# EAGLE design pcb_FINAL (EAGLE 9.6.2)
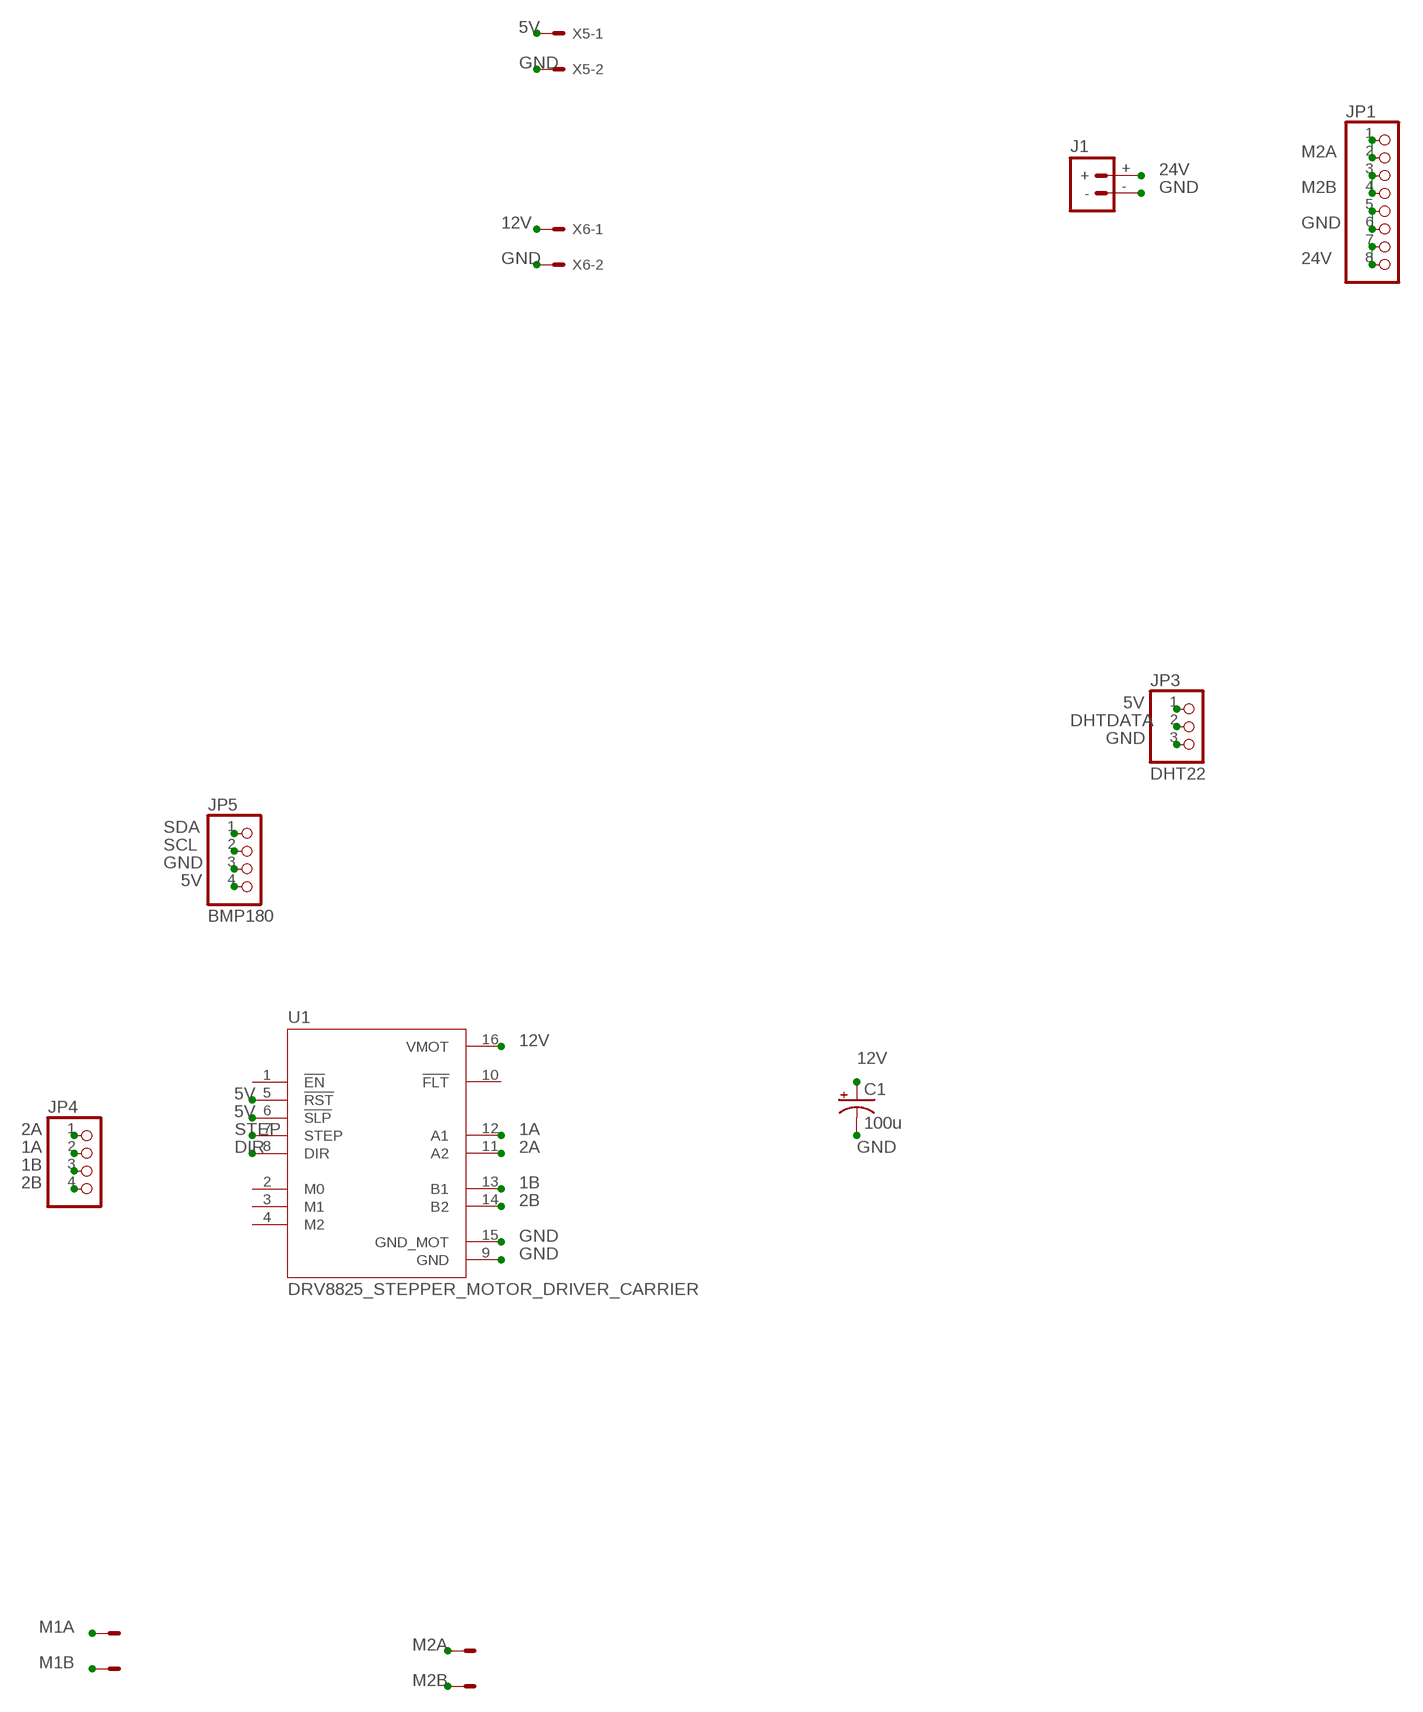
[diagram p0: schematic, sheet 1, part 1 of 2]
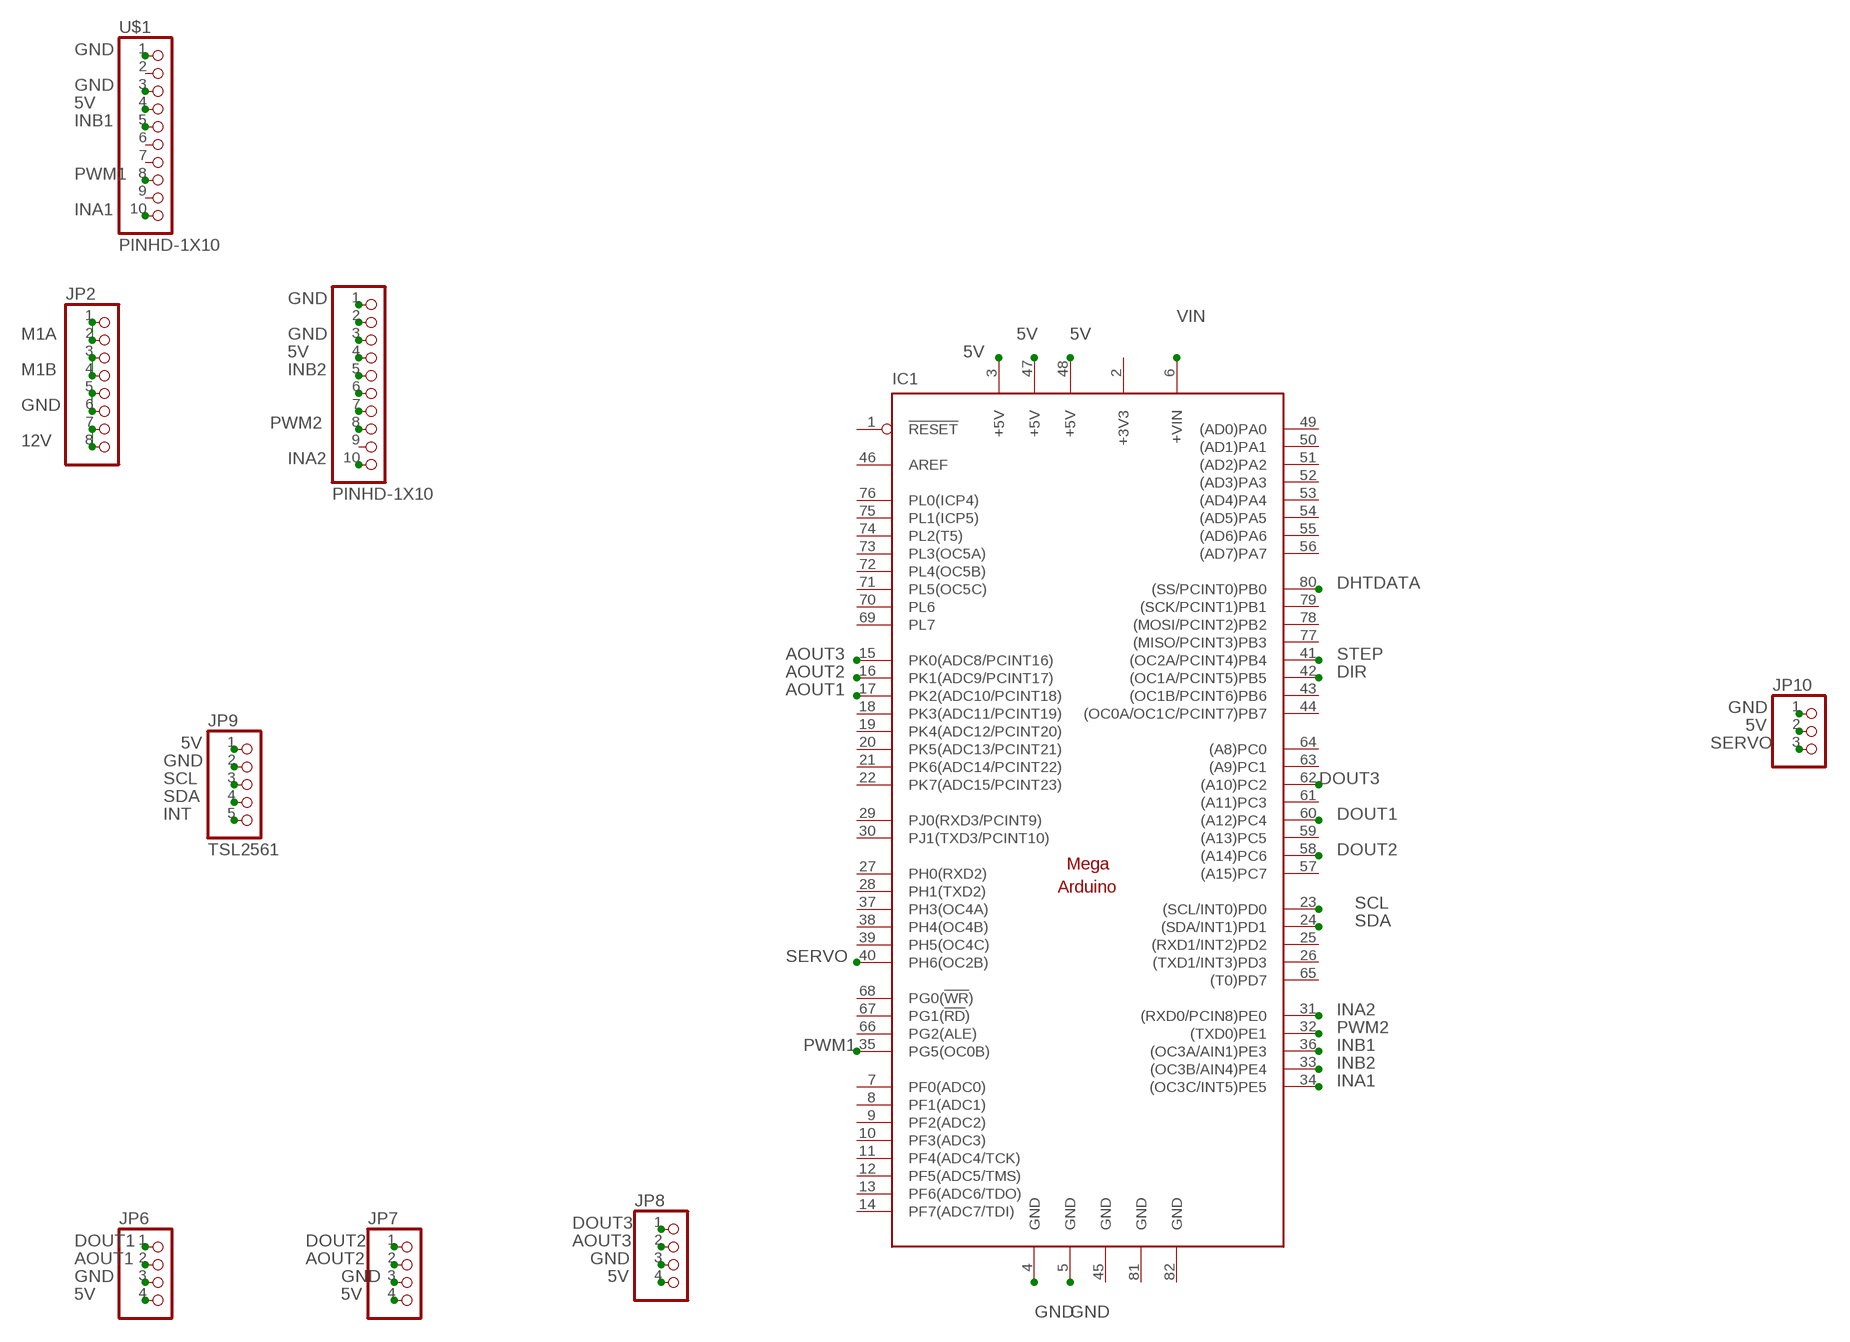
[diagram p1: schematic, sheet 1, part 2 of 2]

## Parts
C1  100u  CPOL-USR/2012-12W  [R/2012-12W]
IC1  ARDUINO_MEGAARDUINO_11  [ARDUINO_MEGA_ARDUINO_1]
J1  BATTERY_CONN_DEANS  [DEANS]
JP1  PINHD-1X8BIG  [1X08-BIG]
JP2  PINHD-1X8BIG  [1X08-BIG]
JP3  DHT22  PINHD-1X3  [1X03]
JP4  PINHD-1X4  [1X04]
JP5  BMP180  PINHD-1X4  [1X04]
JP6  PINHD-1X4  [1X04]
JP7  PINHD-1X4  [1X04]
JP8  PINHD-1X4  [1X04]
JP9  TSL2561  PINHD-1X5  [1X05]
JP10  PINHD-1X3  [1X03]
U1  DRV8825_STEPPER_MOTOR_DRIVER_CARRIER  [IC_DRV8825_STEPPER_MOTOR_DRIVER_CARRIER]
U$1  PINHD-1X10  [1X10-BIG]
U$2  PINHD-1X10  [1X10-BIG]
X3  KK-156-2  [KK-156-2]
X4  KK-156-2  [KK-156-2]
X5  KK-156-2  [KK-156-2]
X6  KK-156-2  [KK-156-2]

## Nets
1A: JP4.2 U1.12(A1)
1B: JP4.3 U1.13(B1)
2A: JP4.1 U1.11(A2)
2B: JP4.4 U1.14(B2)
5V: IC1.3(+5V) IC1.47(+5V) IC1.48(+5V) JP3.1 JP5.4 JP6.4 JP7.4 JP8.4 JP9.1 JP10.2 U1.5(!RST) U1.6(!SLP) U$1.4 U$2.4 X5.1
12V: C1.+ JP2.7 JP2.8 U1.16(VMOT) X6.1
24V: J1.+ JP1.7 JP1.8
AOUT1: IC1.17(PK2(ADC10/PCINT18)) JP6.2
AOUT2: IC1.16(PK1(ADC9/PCINT17)) JP7.2
AOUT3: IC1.15(PK0(ADC8/PCINT16)) JP8.2
DHTDATA: IC1.80((SS/PCINT0)PB0) JP3.2
DIR: IC1.42((OC1A/PCINT5)PB5) U1.8(DIR)
DOUT1: IC1.60((A12)PC4) JP6.1
DOUT2: IC1.58((A14)PC6) JP7.1
DOUT3: IC1.62((A10)PC2) JP8.1
GND: C1.- IC1.4(GND) IC1.5(GND) J1.- JP1.5 JP1.6 JP2.5 JP2.6 JP3.3 JP5.3 JP6.3 JP7.3 JP8.3 JP9.2 JP10.1 U1.9(GND) U1.15(GND_MOT) U$1.1 U$1.3 U$2.1 U$2.3 X5.2 X6.2
INA1: IC1.34((OC3C/INT5)PE5) U$1.10
INA2: IC1.31((RXD0/PCIN8)PE0) U$2.10
INB1: IC1.36((OC3A/AIN1)PE3) U$1.5
INB2: IC1.33((OC3B/AIN4)PE4) U$2.5
INT: JP9.5
M1A: JP2.1 JP2.2 X3.1
M1B: JP2.3 JP2.4 X3.2
M2A: JP1.1 JP1.2 X4.1
M2B: JP1.3 JP1.4 X4.2
N$4: U$2.6
N$5: U$2.7
N$9: U$2.2
PWM1: IC1.35(PG5(OC0B)) U$1.8
PWM2: IC1.32((TXD0)PE1) U$2.8
SCL: IC1.23((SCL/INT0)PD0) JP5.2 JP9.3
SDA: IC1.24((SDA/INT1)PD1) JP5.1 JP9.4
SERVO: IC1.40(PH6(OC2B)) JP10.3
STEP: IC1.41((OC2A/PCINT4)PB4) U1.7(STEP)
VIN: IC1.6(+VIN)
Unconnected: IC1.1(!RESET) IC1.7(PF0(ADC0)) IC1.8(PF1(ADC1)) IC1.9(PF2(ADC2)) IC1.10(PF3(ADC3)) IC1.11(PF4(ADC4/TCK)) IC1.12(PF5(ADC5/TMS)) IC1.13(PF6(ADC6/TDO)) IC1.14(PF7(ADC7/TDI)) IC1.18(PK3(ADC11/PCINT19)) IC1.19(PK4(ADC12/PCINT20)) IC1.20(PK5(ADC13/PCINT21)) IC1.21(PK6(ADC14/PCINT22)) IC1.22(PK7(ADC15/PCINT23)) IC1.25((RXD1/INT2)PD2) IC1.26((TXD1/INT3)PD3) IC1.27(PH0(RXD2)) IC1.28(PH1(TXD2)) IC1.29(PJ0(RXD3/PCINT9)) IC1.30(PJ1(TXD3/PCINT10)) IC1.37(PH3(OC4A)) IC1.38(PH4(OC4B)) IC1.39(PH5(OC4C)) IC1.43((OC1B/PCINT6)PB6) IC1.44((OC0A/OC1C/PCINT7)PB7) IC1.46(AREF) IC1.49((AD0)PA0) IC1.50((AD1)PA1) IC1.51((AD2)PA2) IC1.52((AD3)PA3) IC1.53((AD4)PA4) IC1.54((AD5)PA5) IC1.55((AD6)PA6) IC1.56((AD7)PA7) IC1.57((A15)PC7) IC1.59((A13)PC5) IC1.61((A11)PC3) IC1.63((A9)PC1) IC1.64((A8)PC0) IC1.65((T0)PD7) IC1.66(PG2(ALE)) IC1.67(PG1(!RD!)) IC1.68(PG0(!WR!)) IC1.69(PL7) IC1.70(PL6) IC1.71(PL5(OC5C)) IC1.72(PL4(OC5B)) IC1.73(PL3(OC5A)) IC1.74(PL2(T5)) IC1.75(PL1(ICP5)) IC1.76(PL0(ICP4)) IC1.77((MISO/PCINT3)PB3) IC1.78((MOSI/PCINT2)PB2) IC1.79((SCK/PCINT1)PB1) U1.1(!EN) U1.2(M0) U1.3(M1) U1.4(M2) U1.10(!FLT) U$1.2 U$1.6 U$1.7 U$1.9 U$2.9

## Power pins joined to a net without a drawn wire
+3V3: IC1.2(+3V3)
GND: IC1.45(GND) IC1.81(GND) IC1.82(GND)

## Library data of the parts
C1 = adafruit:CPOL-US: POLARIZED CAPACITOR, American symbol
IC1 = arduino (1):ARDUINO_MEGAARDUINO_1: The Arduino Mega is a microcontroller board based on the ATmega1280. - 54 digital input/output pins (of which 14 can be used as PWM outputs) - 16 analog inputs - 4 UARTs (hardware serial ports) - 16 MHz crystal oscillator - USB connection - power jack - ICSP header - reset button It contains everything needed to support the microcontroller; simply connect it to a computer with a USB cable or power it with a AC-to-DC adapter or battery to get started. The Mega is compatible with most shields designed for the Arduino Duemilanove or Diecimila. http://arduino.cc/en/Main/ArduinoBoardMega
J1 = SparkFun-Connectors:BATTERY_CONN: Battery Connectors Various footprints for battery connections SparkFun Products: Deans Connector -M/F Pair <https://www.sparkfun.com/products/11864>; SF_ID: PRT-11864
JP1 JP2 = adafruit:PINHD-1X8: PIN HEADER
JP3 JP10 = adafruit:PINHD-1X3: PIN HEADER
JP4-JP8 = pinhead:PINHD-1X4: PIN HEADER
JP9 = pinhead:PINHD-1X5: PIN HEADER
U1 = DRV8825_STEPPER_MOTOR_DRIVER_CARRIER:DRV8825_STEPPER_MOTOR_DRIVER_CARRIER: Stepper motor controler; IC: DRV8825; 1.5A; Uin mot: 8.2÷45V Check availability <https://pricing.snapeda.com/parts/DRV8825%20STEPPER%20MOTOR%20DRIVER%20CARRIER/Pololu/view-part?ref=eda>; AVAILABILITY: Not in stock; DESCRIPTION: Stepper, Bipolar 8.2 ~ 45VDC Supply 1.5A 8.2 ~ 45V Load; MF: Pololu; MP: DRV8825 STEPPER MOTOR DRIVER CARRIER; PACKAGE: None; PRICE: None
U$1 U$2 = adafruit:PINHD-1X10: Pin header 1x10 0.1" spacing With round pins
X3-X6 = con-molex:KK-156-2: KK 156 HEADER Source: http://www.molex.com/pdm_docs/sd/026604100_sd.pdf; MF: MOLEX; OC_FARNELL: unknown; OC_NEWARK: unknown

## Board
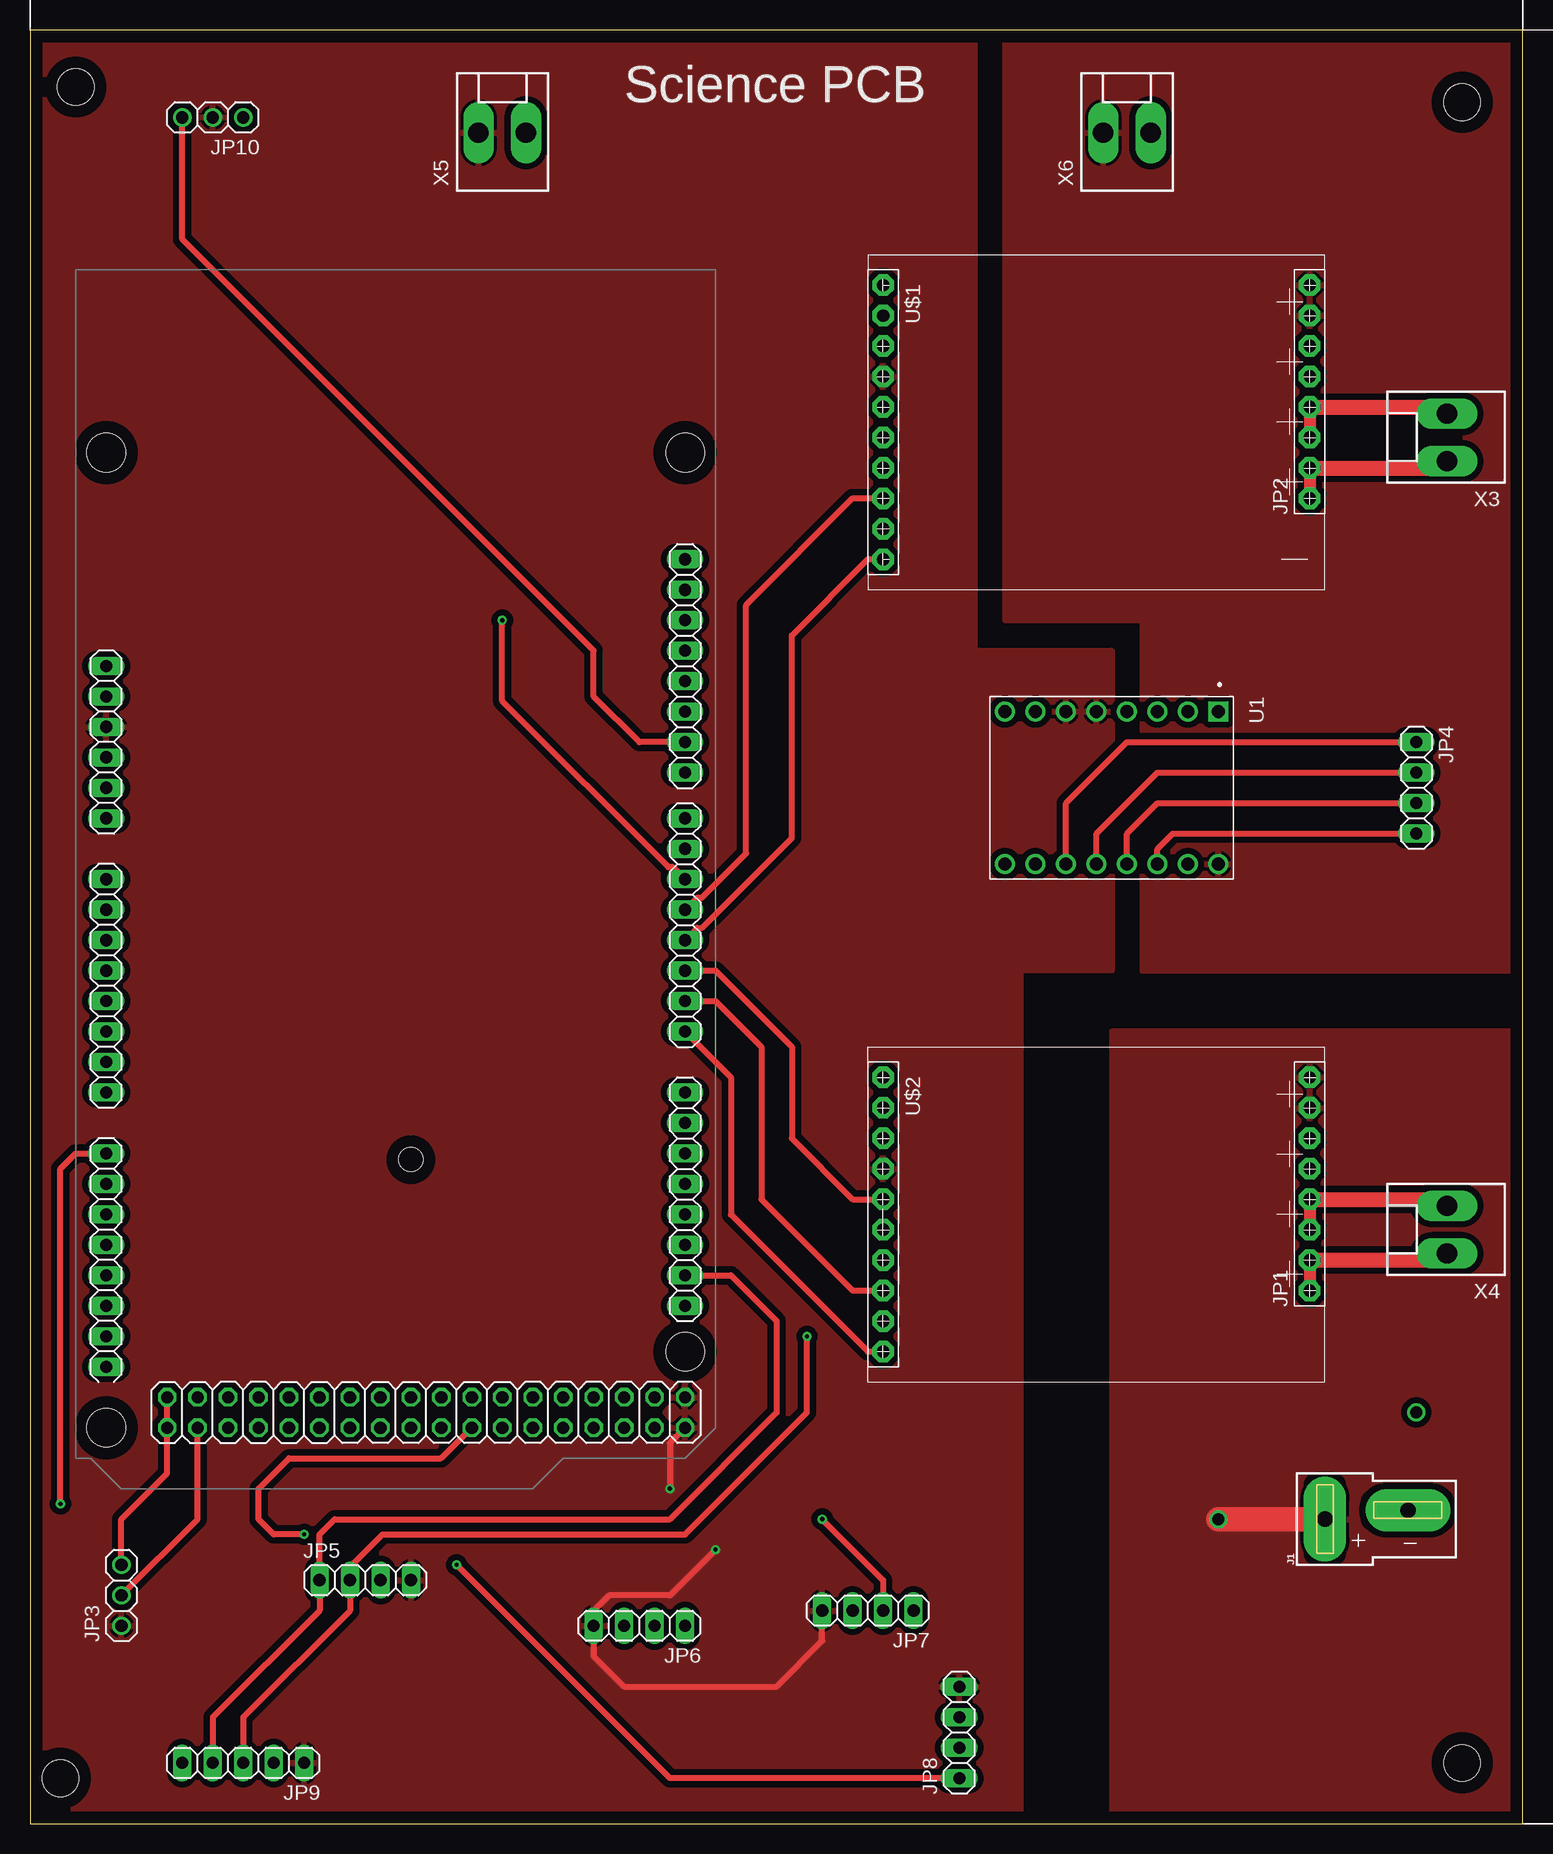
[diagram p2: board, top side]
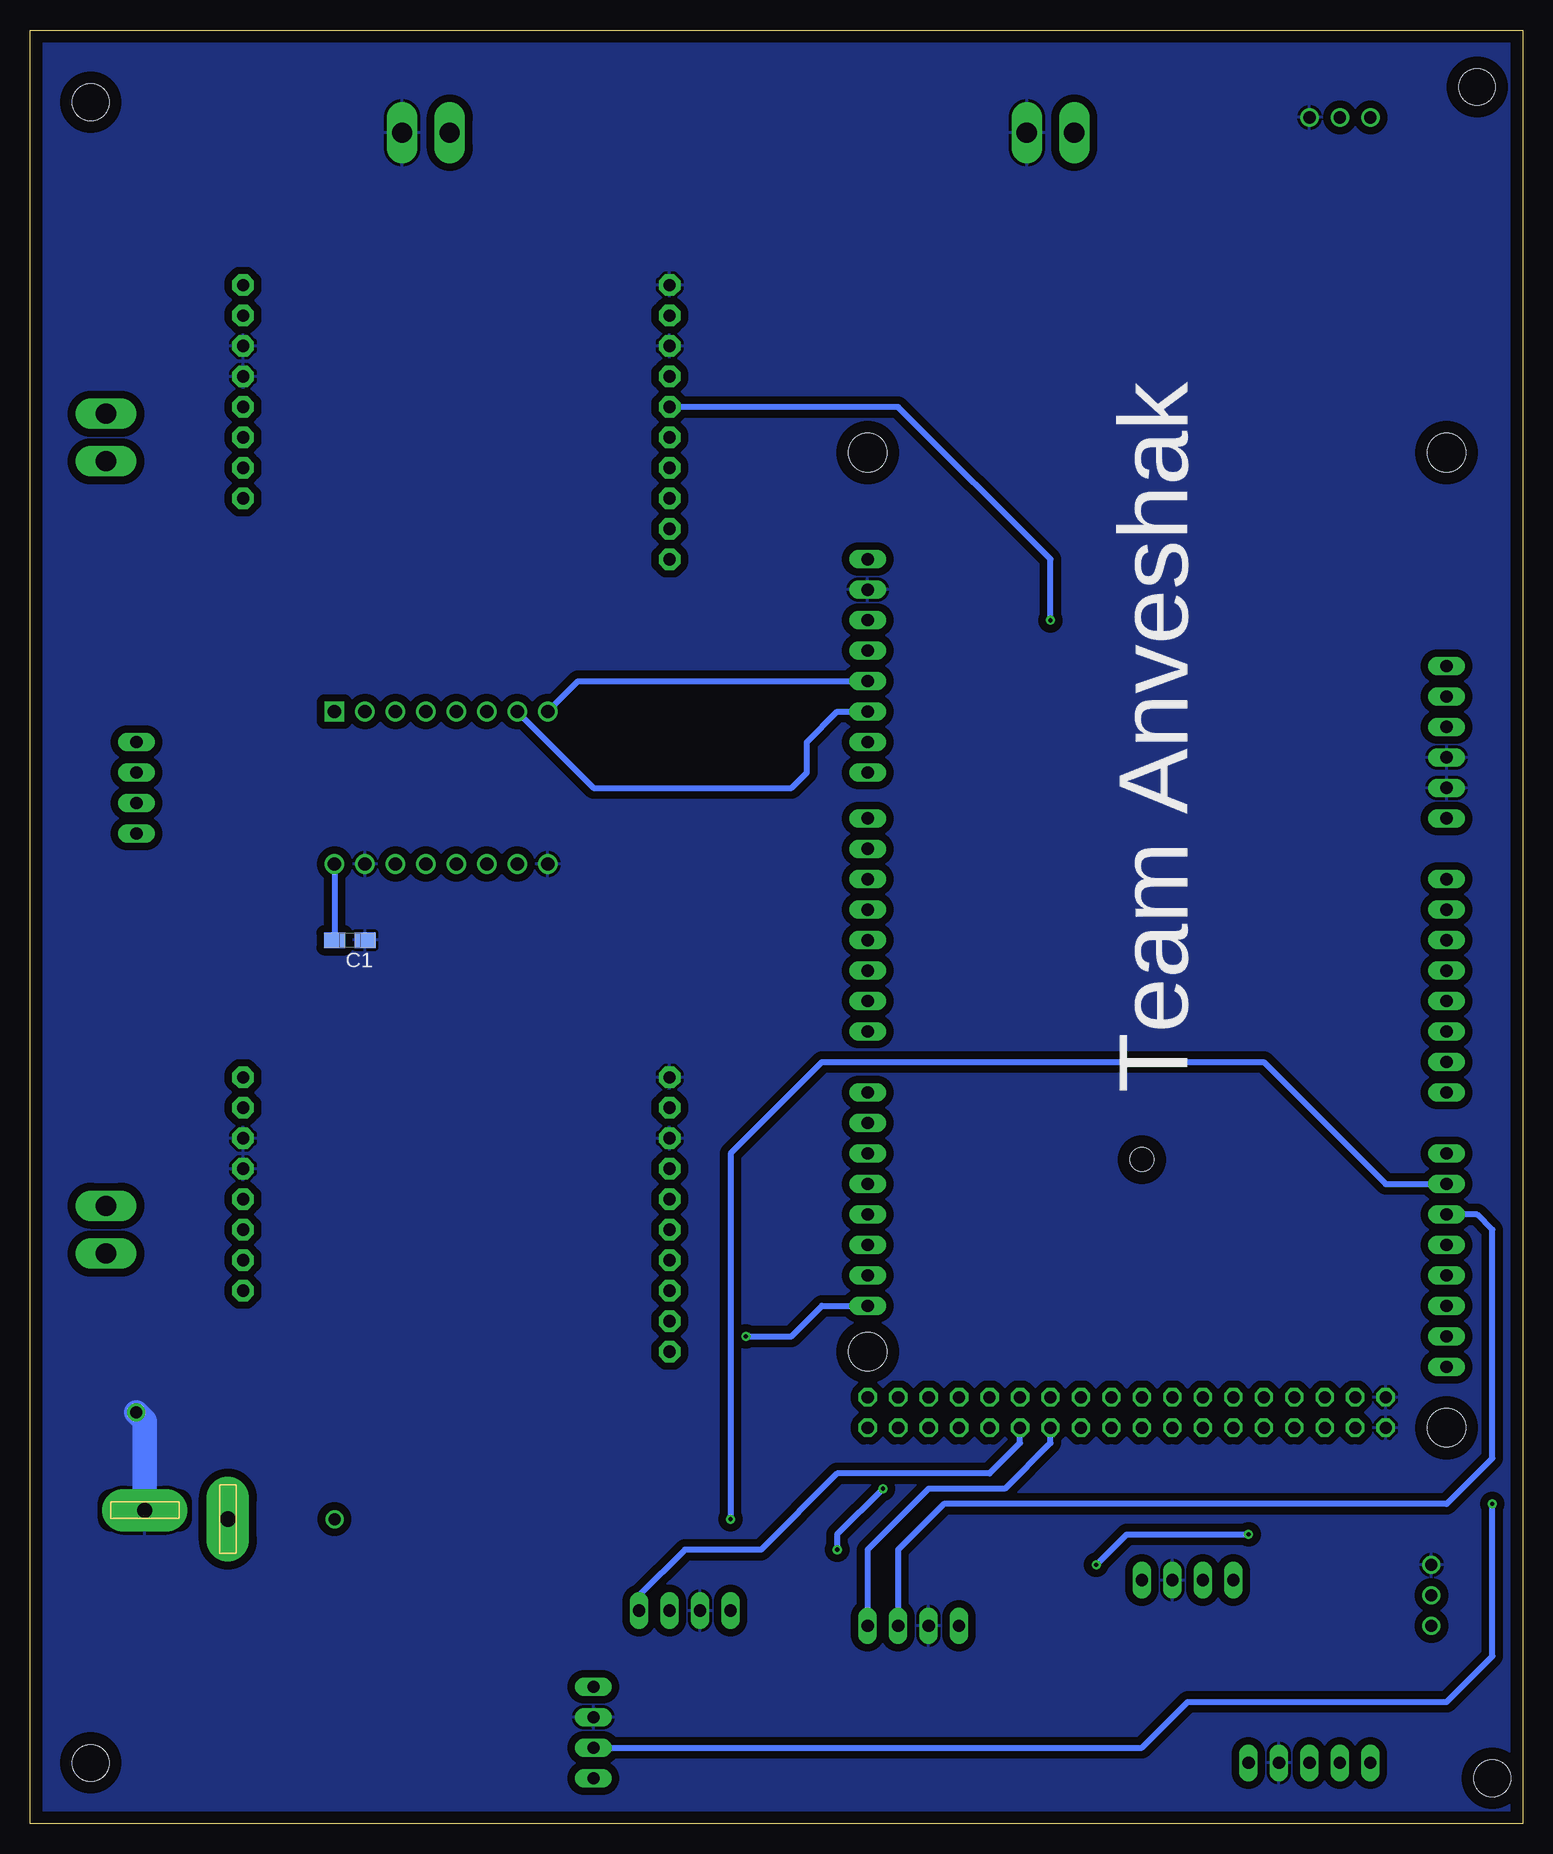
[diagram p3: board, bottom side, seen from below]

Size 124.44 x 149.53 mm. Coordinates in mm from the lower left corner, seen from the top.
Outline: 0,0 124.44,0 124.44,149.53 0,149.53 0,0
Copper layers (1*16): Top 0.035mm / dielectric 1.5mm / Bottom 0.035mm
Design rules "default *": minimum track width 6mil, minimum drill 0.35mm, track to track 20mil, track to pad 20mil, pad to pad 20mil, via to via 20mil, smd to smd 20mil, copper to edge 40mil, drill to drill 6mil, minimum pad ring 10mil, minimum via ring 8mil, stop-mask expansion 4mil, vias tented up to drill 0mil, thermal gap 10mil
Holes 3.05 mm at 3.81,144.78 119.38,143.51 119.38,5.08 2.54,3.81

### Footprints (pad centres in the part's own frame; a part is rotated, then mirrored left to right if it is on the bottom)
R/2012-12W = smd 1.75 x 1.26: + 1.275,0; - -1.275,0
ARDUINO_MEGA_ARDUINO_1 = drill 1.016 long: 1 33.02,2.54; 2 35.56,2.54; 3 38.1,2.54; 4 40.64,2.54; 5 43.18,2.54; 6 45.72,2.54; 7 50.8,2.54; 8 53.34,2.54; 9 55.88,2.54; 10 58.42,2.54; 11 60.96,2.54; 12 63.5,2.54; 13 66.04,2.54; 14 68.58,2.54; 15 73.66,2.54; 16 76.2,2.54; 17 78.74,2.54; 18 81.28,2.54; 19 83.82,2.54; 20 86.36,2.54; 21 88.9,2.54; 22 91.44,2.54; 23 86.36,50.8; 24 83.82,50.8; 25 81.28,50.8; 26 78.74,50.8; 27 76.2,50.8; 28 73.66,50.8; 29 71.12,50.8; 30 68.58,50.8; 31 63.5,50.8; 32 60.96,50.8; 33 58.42,50.8; 34 55.88,50.8; 35 53.34,50.8; 36 50.8,50.8; 37 48.26,50.8; 38 45.72,50.8; 39 41.91,50.8; 40 39.37,50.8; 41 36.83,50.8; 42 34.29,50.8; 43 31.75,50.8; 44 29.21,50.8; 45 26.67,50.8; 46 24.13,50.8 | drill 1.016 octagon: 47 93.98,50.8; 48 96.52,50.8; 49 93.98,48.26; 50 96.52,48.26; 51 93.98,45.72; 52 96.52,45.72; 53 93.98,43.18; 54 96.52,43.18; 55 93.98,40.64; 56 96.52,40.64; 57 93.98,38.1; 58 96.52,38.1; 59 93.98,35.56; 60 96.52,35.56; 61 93.98,33.02; 62 96.52,33.02; 63 93.98,30.48; 64 96.52,30.48; 65 93.98,27.94; 66 96.52,27.94; 67 93.98,25.4; 68 96.52,25.4; 69 93.98,22.86; 70 96.52,22.86; 71 93.98,20.32; 72 96.52,20.32; 73 93.98,17.78; 74 96.52,17.78; 75 93.98,15.24; 76 96.52,15.24; 77 93.98,12.7; 78 96.52,12.7; 79 93.98,10.16; 80 96.52,10.16; 81 93.98,7.62; 82 96.52,7.62 | hole 3.2: 15.24,50.8; 15.24,2.54; 90.17,50.8; 96.52,2.54 | hole 2: 74.168,27.94
DEANS = drill 1.27 pad 3.556 long: + 0,0; - 0.737,-6.921
1X08-BIG = drill 1.016 pad 1.778 octagon: 1 -8.89,0; 2 -6.35,0; 3 -3.81,0; 4 -1.27,0; 5 1.27,0; 6 3.81,0; 7 6.35,0; 8 8.89,0
1X03 = drill 1.016: 1 -2.54,0; 2 0,0; 3 2.54,0
1X04 = drill 1.016 long: 1 -3.81,0; 2 -1.27,0; 3 1.27,0; 4 3.81,0
1X05 = drill 1.016 long: 1 -5.08,0; 2 -2.54,0; 3 0,0; 4 2.54,0; 5 5.08,0
IC_DRV8825_STEPPER_MOTOR_DRIVER_CARRIER = drill 1.1 square: 1 -6.35,8.89 | drill 1.1: 2 -6.35,6.35; 3 -6.35,3.81; 4 -6.35,1.27; 5 -6.35,-1.27; 6 -6.35,-3.81; 7 -6.35,-6.35; 8 -6.35,-8.89; 9 6.35,-8.89; 10 6.35,-6.35; 11 6.35,-3.81; 12 6.35,-1.27; 13 6.35,1.27; 14 6.35,3.81; 15 6.35,6.35; 16 6.35,8.89
1X10-BIG = drill 1.016 pad 1.778 octagon: 1 -11.43,0; 2 -8.89,0; 3 -6.35,0; 4 -3.81,0; 5 -1.27,0; 6 1.27,0; 7 3.81,0; 8 6.35,0; 9 8.89,0; 10 11.43,0
KK-156-2 = drill 1.7 pad 2.184 long: 1 -1.98,0; 2 1.98,0

### Placement (x,y rotation side)
C1  97.79,73.66 180 bottom
IC1  3.81,129.54 270 top
J1  107.95,25.4 90 top
JP1  106.68,53.34 90 top
JP2  106.68,119.38 90 top
JP3  7.62,19.05 90 top
JP4  115.57,86.36 270 top
JP5  27.94,20.32 0 top
JP6  50.8,16.51 180 top
JP7  69.85,17.78 180 top
JP8  77.47,7.62 90 top
JP9  17.78,5.08 180 top
JP10  15.24,142.24 180 top
U1  90.17,86.36 270 top
U$1  71.12,116.84 270 top
U$2  71.12,50.8 270 top
X3  118.11,115.57 90 top
X4  118.11,49.53 90 top
X5  39.37,140.97 0 top
X6  91.44,140.97 0 top

### Tracks (layer width: path | path; a pad name or v marks a point on that pad's centre or on a via)
1A
  Top 0.508: U1.12 88.9,82.55 93.98,87.63 JP4.2
1B
  Top 0.508: U1.13 91.44,82.55 93.98,85.09 JP4.3
2A
  Top 0.508: U1.11 86.36,85.09 91.44,90.17 JP4.1
2B
  Top 0.508: U1.14 93.98,81.28 95.25,82.55 JP4.4
5V  (via drill 0.35)
  Top 0.508: JP7.4 66.04,15.24 62.23,11.43 49.53,11.43 46.99,13.97 JP6.4 46.99,17.78 48.26,19.05 53.34,19.05 v57.15,22.86 | IC1.48 53.34,31.75 v53.34,27.94
  Bottom 0.508: v53.34,27.94 57.15,24.13 v57.15,22.86
  pour Top: -7.62,151.13 78.74,151.13 78.74,97.79 90.17,97.79 90.17,71.12 82.55,71.12 82.55,-2.54 -7.62,-2.54
12V
  Bottom 0.508: U1.16 C1.+
  pour Top: 81.28,151.13 81.28,100.33 92.71,100.33 92.71,71.12 128.27,71.12 128.27,151.13
24V  (via drill 1)
  Top 2.032: J1.+ v99.06,25.4
  pour Top: 125.73,66.04 90.17,66.04 90.17,-2.54 129.54,-2.54 129.54,66.04
AOUT1
  Bottom 0.508: IC1.17 3.81,50.8 2.54,49.53 2.54,30.48 6.35,26.67 48.26,26.67 52.07,22.86 JP6.2
AOUT2  (via drill 0.35)
  Top 0.508: v66.04,25.4 71.12,20.32 JP7.2
  Bottom 0.508: IC1.16 11.43,53.34 21.59,63.5 58.42,63.5 66.04,55.88 v66.04,25.4
AOUT3  (via drill 0.35)
  Top 0.508: v2.54,26.67 2.54,54.61 3.81,55.88 IC1.15
  Bottom 0.508: JP8.2 31.75,6.35 27.94,10.16 6.35,10.16 2.54,13.97 v2.54,26.67
DHTDATA
  Top 0.508: JP3.2 13.97,25.4 IC1.80
DIR
  Bottom 0.508: U1.8 78.74,95.25 IC1.42
DOUT1
  Bottom 0.508: IC1.60 39.37,31.75 43.18,27.94 49.53,27.94 54.61,22.86 JP6.1
DOUT2
  Bottom 0.508: IC1.58 41.91,31.75 44.45,29.21 57.15,29.21 63.5,22.86 69.85,22.86 73.66,19.05 JP7.1
DOUT3  (via drill 0.35)
  Top 0.508: JP8.1 53.34,3.81 v35.56,21.59 | v22.86,24.13 20.32,24.13 19.05,25.4 19.05,27.94 21.59,30.48 34.29,30.48 IC1.62
  Bottom 0.508: v35.56,21.59 33.02,24.13 v22.86,24.13
GND  (via drill 1)
  Top 0.508: JP3.3 7.62,25.4 11.43,29.21 IC1.82 IC1.81
  Bottom 2.032: J1.- 114.87,33.59 v115.57,34.29
  pour Bottom (isolate 0.635): -7.62,149.86 -7.62,-1.27 138.43,-1.27 138.43,149.86
INA1
  Top 0.508: IC1.34 55.63,74.68 56,74.68 63.5,82.17 63.5,99.06 69.85,105.41 U$1.10
INA2
  Top 0.508: IC1.31 58.42,62.23 58.42,50.8 69.85,39.37 U$2.10
INB1  (via drill 0.35)
  Top 0.508: IC1.36 53.59,79.76 53.22,79.76 39.37,93.6 v39.37,100.33
  Bottom 0.508: v39.37,100.33 39.37,105.41 52.07,118.11 U$1.5
INB2
  Top 0.508: IC1.33 57.15,71.12 63.5,64.77 63.5,57.15 68.58,52.07 U$2.5
M1A
  Top 1.016: JP2.2 JP2.1
  Top 1.27: JP2.2 117.55,113.03 X3.1
M1B
  Top 1.016: JP2.4 JP2.3
  Top 1.27: JP2.4 117.55,118.11 X3.2
M2A
  Top 1.016: JP1.2 JP1.1
  Top 1.27: JP1.2 117.55,46.99 X4.1
M2B
  Top 1.016: JP1.4 JP1.3
  Top 1.27: JP1.4 117.55,52.07 X4.2
PWM1
  Top 0.508: IC1.35 55.63,77.22 56,77.22 59.69,80.9 59.69,101.6 68.58,110.49 U$1.8
PWM2
  Top 0.508: IC1.32 57.15,68.58 60.96,64.77 60.96,52.07 68.58,44.45 U$2.8
SCL  (via drill 0.35)
  Top 0.508: v64.77,40.64 64.77,34.29 54.61,24.13 29.38,24.13 26.67,21.42 JP5.2 26.67,17.78 17.78,8.89 JP9.3
  Bottom 0.508: v64.77,40.64 60.96,40.64 58.42,43.18 IC1.23
SDA
  Top 0.508: IC1.24 58.42,45.72 62.23,41.91 62.23,34.29 53.34,25.4 25.4,25.4 24.13,24.13 JP5.1 24.13,17.78 15.24,8.89 JP9.4
SERVO
  Top 0.508: JP10.3 12.7,132.08 46.99,97.79 46.99,93.98 50.8,90.17 IC1.40
STEP
  Bottom 0.508: U1.7 77.47,86.36 60.96,86.36 59.69,87.63 59.69,90.17 57.15,92.71 IC1.41

### Text on the board
tPlace: Science PCB
bPlace: Team Anveshak